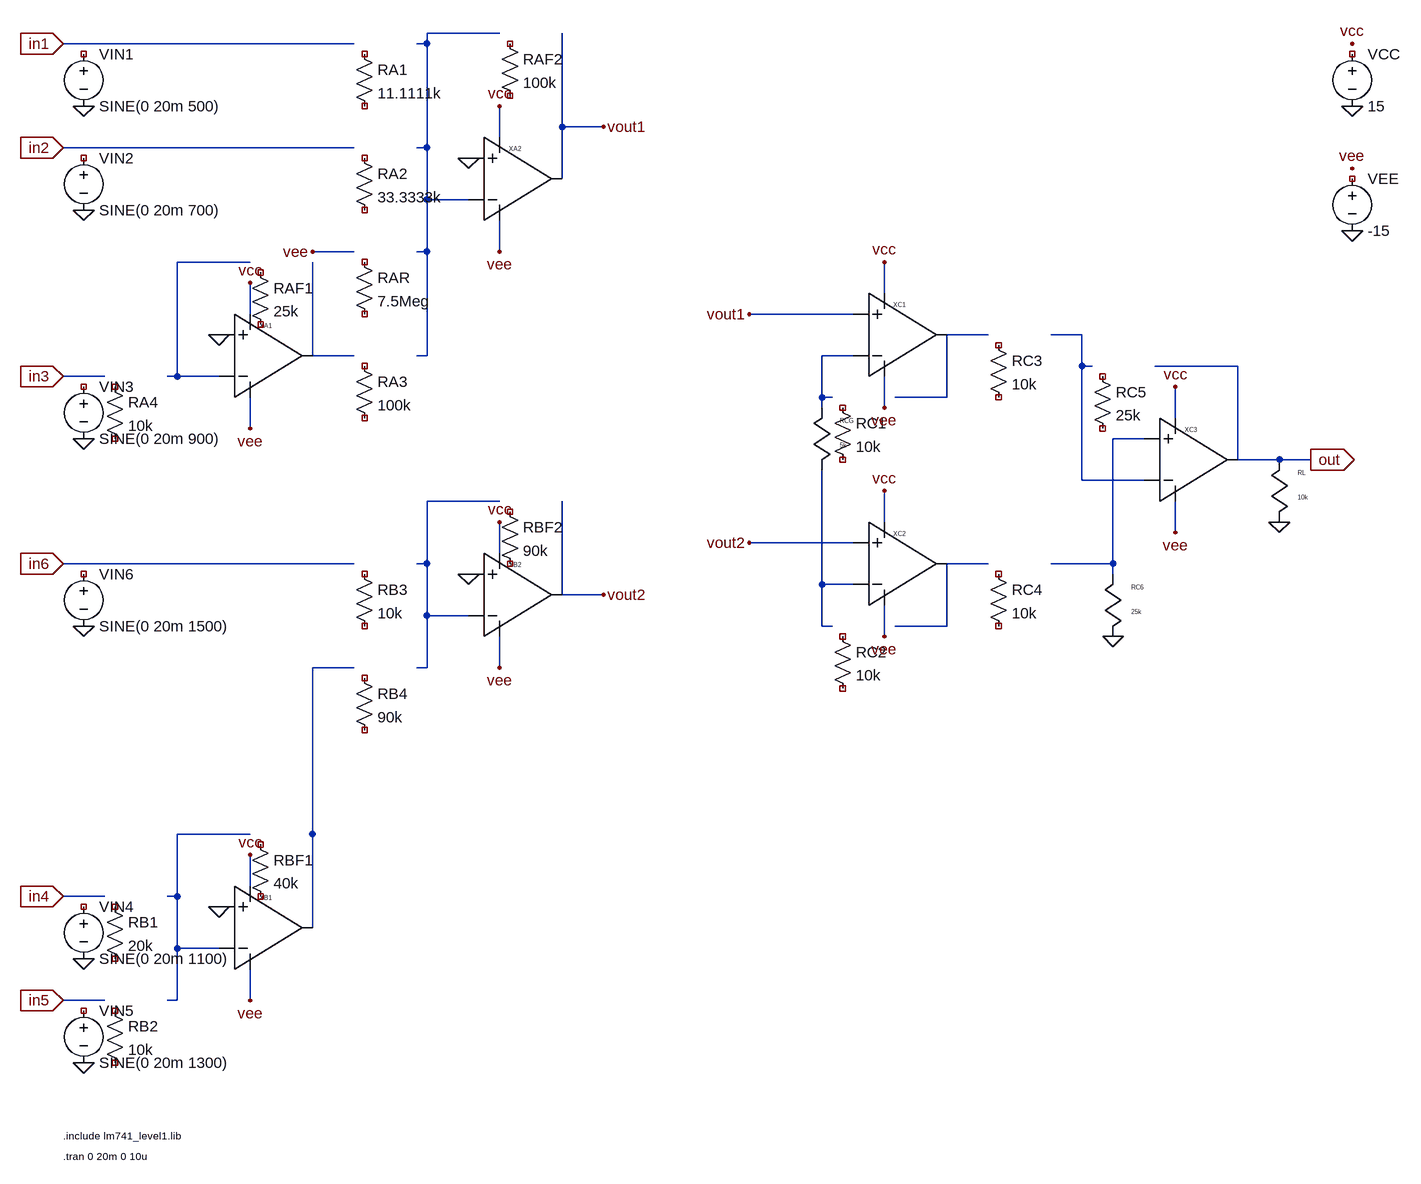
[diagram p0: schematic rs2_completo.asc]
rs2_completo.asc, the LTspice schematic file:
Version 4
SHEET 1 2309 1991
WIRE 608 96 624 96
WIRE 608 256 624 256
WIRE 608 416 624 416
WIRE 608 576 624 576
WIRE 624 80 624 576
WIRE 624 336 688 336
WIRE 736 240 736 192
WIRE 736 368 736 416
WIRE 624 80 736 80
WIRE 832 80 832 304
WIRE 224 608 240 608
WIRE 240 432 240 608
WIRE 240 608 304 608
WIRE 352 512 352 464
WIRE 352 640 352 688
WIRE 240 432 352 432
WIRE 448 432 448 576
WIRE 448 416 512 416
WIRE 448 576 512 576
WIRE 64 96 512 96
WIRE 64 256 512 256
WIRE 64 608 128 608
WIRE 832 224 896 224
WIRE 608 896 624 896
WIRE 608 1056 624 1056
WIRE 624 800 624 1056
WIRE 624 976 688 976
WIRE 736 880 736 832
WIRE 736 1008 736 1056
WIRE 624 800 736 800
WIRE 832 800 832 944
WIRE 224 1408 240 1408
WIRE 224 1568 240 1568
WIRE 240 1312 240 1568
WIRE 240 1488 304 1488
WIRE 352 1392 352 1344
WIRE 352 1520 352 1568
WIRE 240 1312 352 1312
WIRE 448 1312 448 1456
WIRE 448 1456 448 1056
WIRE 448 1056 512 1056
WIRE 64 896 512 896
WIRE 64 1408 128 1408
WIRE 64 1568 128 1568
WIRE 832 944 896 944
WIRE 1328 480 1328 432
WIRE 1328 608 1328 656
WIRE 1328 832 1328 784
WIRE 1328 960 1328 1008
WIRE 1776 672 1776 624
WIRE 1776 800 1776 848
WIRE 1120 512 1280 512
WIRE 1120 864 1280 864
WIRE 1232 576 1280 576
WIRE 1232 576 1232 656
WIRE 1232 640 1248 640
WIRE 1344 640 1424 640
WIRE 1424 640 1424 544
WIRE 1232 752 1232 992
WIRE 1232 928 1280 928
WIRE 1232 992 1248 992
WIRE 1344 992 1424 992
WIRE 1424 992 1424 896
WIRE 1424 544 1488 544
WIRE 1584 544 1632 544
WIRE 1632 544 1632 768
WIRE 1632 768 1728 768
WIRE 1424 896 1488 896
WIRE 1584 896 1680 896
WIRE 1680 896 1680 704
WIRE 1680 704 1728 704
WIRE 1632 592 1648 592
WIRE 1744 592 1872 592
WIRE 1872 592 1872 736
WIRE 1680 896 1680 912
WIRE 1872 736 1984 736
SYMBOL res 512 96 R0
SYMATTR InstName RA1
SYMATTR Value 11.1111k
SYMBOL res 512 256 R0
SYMATTR InstName RA2
SYMATTR Value 33.3333k
SYMBOL res 512 416 R0
SYMATTR InstName RAR
SYMATTR Value 7.5Meg
SYMBOL res 512 576 R0
SYMATTR InstName RA3
SYMATTR Value 100k
SYMBOL opamp2 688 240 R0
SYMATTR InstName XA2
SYMATTR Value LM741_LEVEL1
SYMBOL res 736 80 R0
SYMATTR InstName RAF2
SYMATTR Value 100k
SYMBOL res 128 608 R0
SYMATTR InstName RA4
SYMATTR Value 10k
SYMBOL opamp2 304 512 R0
SYMATTR InstName XA1
SYMATTR Value LM741_LEVEL1
SYMBOL res 352 432 R0
SYMATTR InstName RAF1
SYMATTR Value 25k
SYMBOL voltage 96 96 R0
SYMATTR InstName VIN1
SYMATTR Value SINE(0 20m 500)
SYMBOL voltage 96 256 R0
SYMATTR InstName VIN2
SYMATTR Value SINE(0 20m 700)
SYMBOL voltage 96 608 R0
SYMATTR InstName VIN3
SYMATTR Value SINE(0 20m 900)
SYMBOL res 512 896 R0
SYMATTR InstName RB3
SYMATTR Value 10k
SYMBOL res 512 1056 R0
SYMATTR InstName RB4
SYMATTR Value 90k
SYMBOL opamp2 688 880 R0
SYMATTR InstName XB2
SYMATTR Value LM741_LEVEL1
SYMBOL res 736 800 R0
SYMATTR InstName RBF2
SYMATTR Value 90k
SYMBOL res 128 1408 R0
SYMATTR InstName RB1
SYMATTR Value 20k
SYMBOL res 128 1568 R0
SYMATTR InstName RB2
SYMATTR Value 10k
SYMBOL opamp2 304 1392 R0
SYMATTR InstName XB1
SYMATTR Value LM741_LEVEL1
SYMBOL res 352 1312 R0
SYMATTR InstName RBF1
SYMATTR Value 40k
SYMBOL voltage 96 896 R0
SYMATTR InstName VIN6
SYMATTR Value SINE(0 20m 1500)
SYMBOL voltage 96 1408 R0
SYMATTR InstName VIN4
SYMATTR Value SINE(0 20m 1100)
SYMBOL voltage 96 1568 R0
SYMATTR InstName VIN5
SYMATTR Value SINE(0 20m 1300)
SYMBOL opamp2 1280 480 R0
SYMATTR InstName XC1
SYMATTR Value LM741_LEVEL1
SYMBOL opamp2 1280 832 R0
SYMATTR InstName XC2
SYMATTR Value LM741_LEVEL1
SYMBOL opamp2 1728 672 R0
SYMATTR InstName XC3
SYMATTR Value LM741_LEVEL1
SYMBOL res 1248 640 R0
SYMATTR InstName RC1
SYMATTR Value 10k
SYMBOL res_v 1232 656 R0
SYMATTR InstName RCG
SYMATTR Value 5k
SYMBOL res 1248 992 R0
SYMATTR InstName RC2
SYMATTR Value 10k
SYMBOL res 1488 544 R0
SYMATTR InstName RC3
SYMATTR Value 10k
SYMBOL res 1488 896 R0
SYMATTR InstName RC4
SYMATTR Value 10k
SYMBOL res 1648 592 R0
SYMATTR InstName RC5
SYMATTR Value 25k
SYMBOL res_v 1680 912 R0
SYMATTR InstName RC6
SYMATTR Value 25k
SYMBOL res_v 1936 736 R0
SYMATTR InstName RL
SYMATTR Value 10k
SYMBOL voltage 2048 96 R0
SYMATTR InstName VCC
SYMATTR Value 15
SYMBOL voltage 2048 288 R0
SYMATTR InstName VEE
SYMATTR Value -15
FLAG 688 272 0
FLAG 736 192 vcc
FLAG 736 416 vee
FLAG 304 544 0
FLAG 352 464 vcc
FLAG 352 688 vee
FLAG 448 416 vee
FLAG 96 192 0
FLAG 64 96 in1
IOPIN 64 96 In
FLAG 96 352 0
FLAG 64 256 in2
IOPIN 64 256 In
FLAG 96 704 0
FLAG 64 608 in3
IOPIN 64 608 In
FLAG 896 224 vout1
FLAG 688 912 0
FLAG 736 832 vcc
FLAG 736 1056 vee
FLAG 304 1424 0
FLAG 352 1344 vcc
FLAG 352 1568 vee
FLAG 96 992 0
FLAG 64 896 in6
IOPIN 64 896 In
FLAG 96 1504 0
FLAG 64 1408 in4
IOPIN 64 1408 In
FLAG 96 1664 0
FLAG 64 1568 in5
IOPIN 64 1568 In
FLAG 896 944 vout2
FLAG 1328 432 vcc
FLAG 1328 656 vee
FLAG 1328 784 vcc
FLAG 1328 1008 vee
FLAG 1776 624 vcc
FLAG 1776 848 vee
FLAG 1680 1008 0
FLAG 1120 512 vout1
FLAG 1120 864 vout2
FLAG 1936 832 0
FLAG 1984 736 out
IOPIN 1984 736 Out
FLAG 2048 96 vcc
FLAG 2048 192 0
FLAG 2048 288 vee
FLAG 2048 384 0
TEXT 64 1776 Left 1 !.include lm741_level1.lib
TEXT 64 1808 Left 1 !.tran 0 20m 0 10u

The netlist it stands for:
* rs2_completo.asc
RA1 NC_01 NC_02 11.1111k
RA2 NC_03 NC_04 33.3333k
RAR NC_05 NC_06 7.5Meg
RA3 NC_07 NC_08 100k
XXA2 CLAW_IDEAL_OPAMP LM741_LEVEL1
RAF2 NC_09 NC_10 100k
RA4 NC_11 NC_12 10k
XXA1 CLAW_IDEAL_OPAMP LM741_LEVEL1
RAF1 NC_13 NC_14 25k
VIN1 NC_15 0 SINE(0 20m 500)
VIN2 NC_16 0 SINE(0 20m 700)
VIN3 NC_17 0 SINE(0 20m 900)
RB3 NC_18 NC_19 10k
RB4 NC_20 NC_21 90k
XXB2 CLAW_IDEAL_OPAMP LM741_LEVEL1
RBF2 NC_22 NC_23 90k
RB1 NC_24 NC_25 20k
RB2 NC_26 NC_27 10k
XXB1 CLAW_IDEAL_OPAMP LM741_LEVEL1
RBF1 NC_28 NC_29 40k
VIN6 NC_30 0 SINE(0 20m 1500)
VIN4 NC_31 0 SINE(0 20m 1100)
VIN5 NC_32 0 SINE(0 20m 1300)
XXC1 CLAW_IDEAL_OPAMP LM741_LEVEL1
XXC2 CLAW_IDEAL_OPAMP LM741_LEVEL1
XXC3 CLAW_IDEAL_OPAMP LM741_LEVEL1
RC1 NC_33 NC_34 10k
RCG N007 N009 5k
RC2 NC_35 NC_36 10k
RC3 NC_37 NC_38 10k
RC4 NC_39 NC_40 10k
RC5 NC_41 NC_42 25k
RC6 N012 0 25k
RL out 0 10k
VCC NC_43 0 15
VEE NC_44 0 -15
.include lm741_level1.lib
.tran 0 20m 0 10u
.backanno
.end